# Altium schematic sheet Debug Board.SchDoc
size A
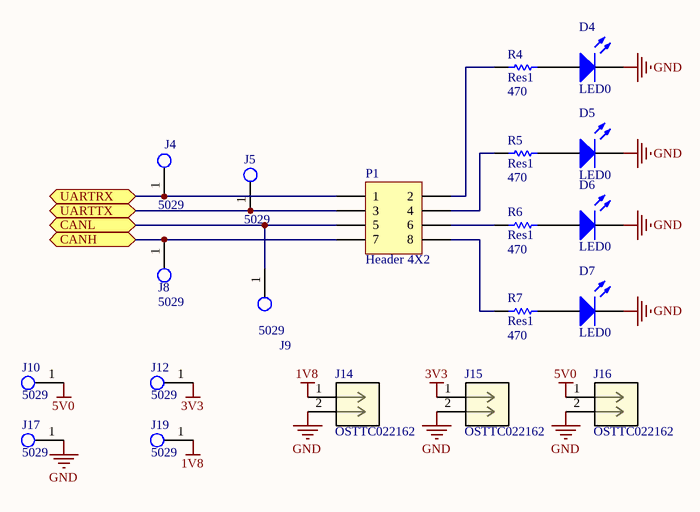
[diagram p0: Debug Board.SchDoc]

## Parts
D4  LED0  [1608[0603]]
D5  LED0  [1608[0603]]
D6  LED0  [1608[0603]]
D7  LED0  [1608[0603]]
J4  5029  [EXPOSED PAD 0.02X0.02]
J5  5029  [EXPOSED PAD 0.02X0.02]
J8  5029  [EXPOSED PAD 0.02X0.02]
J9  5029  [EXPOSED PAD 0.02X0.02]
J10  5029  [EXPOSED PAD 0.02X0.02]
J12  5029  [EXPOSED PAD 0.02X0.02]
J14  OSTTC022162  [CONN_OSTTC022162_OST]
J15  OSTTC022162  [CONN_OSTTC022162_OST]
J16  OSTTC022162  [CONN_OSTTC022162_OST]
J17  5029  [EXPOSED PAD 0.02X0.02]
J19  5029  [EXPOSED PAD 0.02X0.02]
P1  Header 4X2  [HDR2X4]
R4  Res1  value 470  [1608[0603]]
R5  Res1  value 470  [1608[0603]]
R6  Res1  value 470  [1608[0603]]
R7  Res1  value 470  [1608[0603]]

## Ports
CANH (bidir), CANL (bidir), UARTRX (bidir), UARTTX (bidir)

## Nets
1V8: J14.1 J19.1
3V3: J12.1 J15.1
5V0: J10.1 J16.1
GND: D4.2(K) D5.2(K) D6.2(K) D7.2(K) J14.2 J15.2 J16.2 J17.1
CANH: J8.1 P1.7 ; port CANH
CANL: J9.1 P1.5 ; port CANL
UARTRX: J4.1 P1.1 ; port UARTRX
UARTTX: J5.1 P1.3 ; port UARTTX
NetD4_1: D4.1(A) R4.1
NetD5_1: D5.1(A) R5.1
NetD6_1: D6.1(A) R6.1
NetD7_1: D7.1(A) R7.1
NetP1_2: P1.2 R4.2
NetP1_4: P1.4 R5.2
NetP1_6: P1.6 R6.2
NetP1_8: P1.8 R7.2

## Library data of the parts
J14-J16 = OSTTC022162: No Description Available; Vendor: On Shore Technology Inc; Built_By: EMA_Cory; SourceLibrary: On_Shore_Technology_2019-12-02; Manufacturer_Part_Number: OSTTC022162; Copyright: Copyright (C) 2018 Accelerated Designs. All rights reserved; RefDes: RefDes; Type: DEV
P1 = Header 4X2: Header, 4-Pin, Dual row; LatestRevisionDate: 17-Jul-2002; LatestRevisionNote: Re-released for DXP Platform.; Publisher: Altium Limited
R4-R7 = Res1: Resistor; Published: 8-Jun-2000; LatestRevisionDate: 17-Jul-2002; LatestRevisionNote: Re-released for DXP Platform.; PackageReference: AXIAL-0.3; Publisher: Altium Limited; PackageDescription: Axial Device, Thru-Hole; 2 Leads; 0.3 in Pin Spacing
D4-D7 = LED0: Published: 8-Jun-2000; LatestRevisionDate: 08-Jul-2005; LatestRevisionNote: Mech Layer 1 removed.; PackageReference: LED-0; Publisher: Altium Limited; PackageDescription: LED; 2 Leads